# Altium project VM03_hv4.PrjPcb
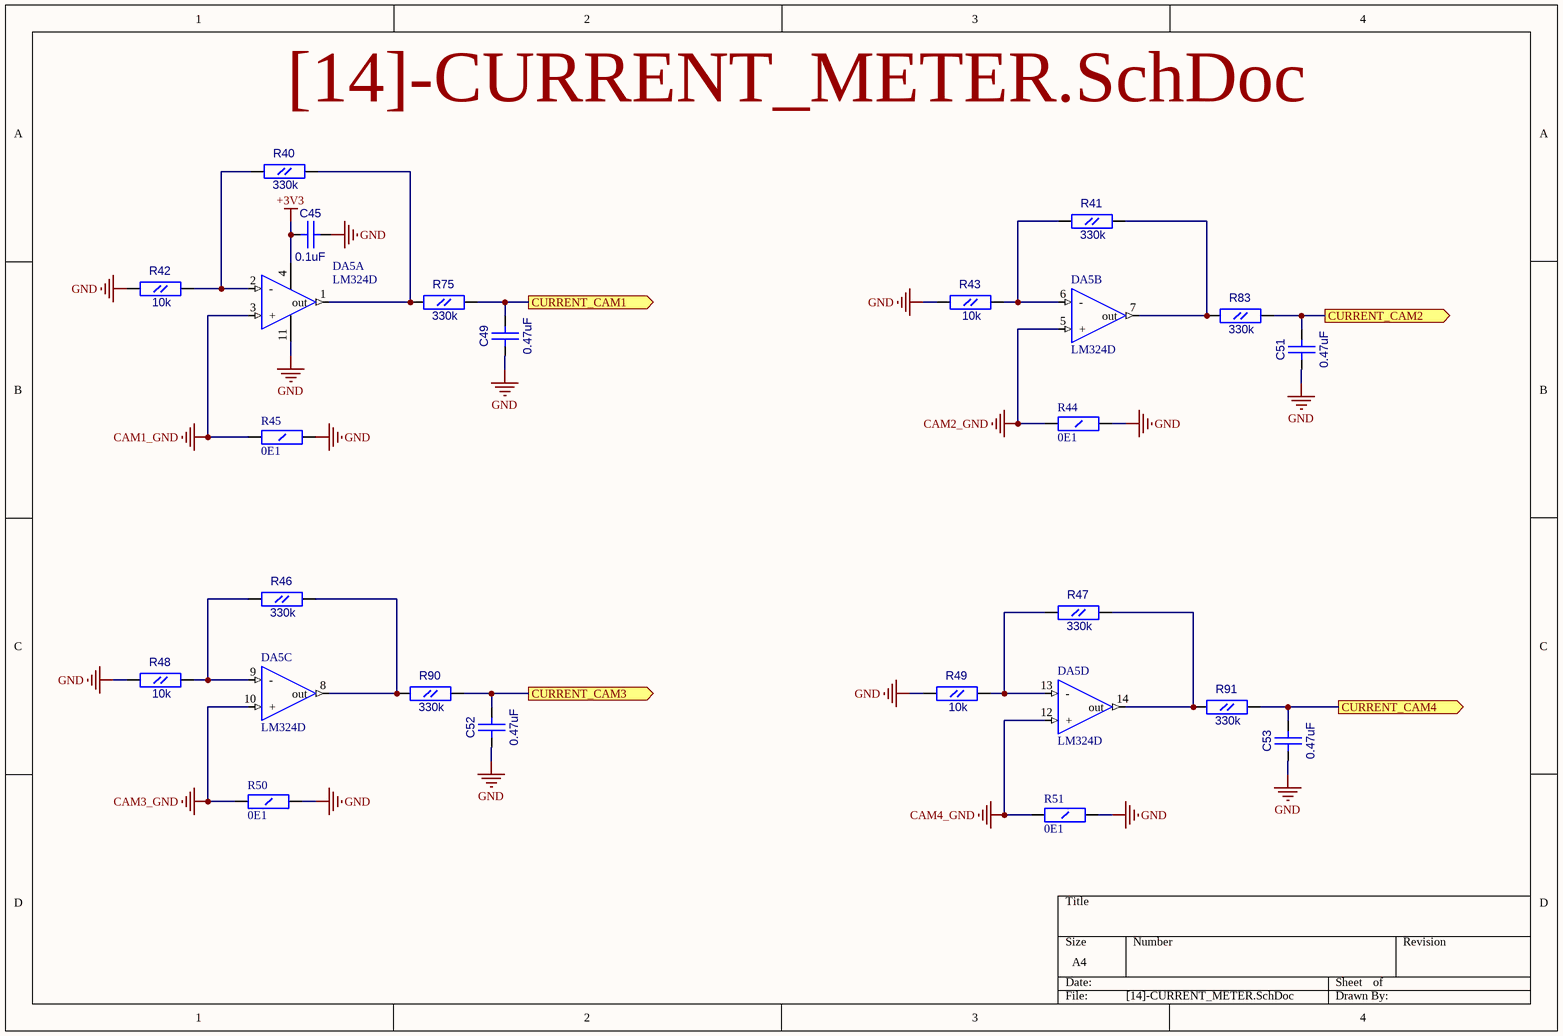
[diagram p0: [14]-CURRENT_METER.SchDoc]
3 sheets, 50 parts. Net scope: flat (ports and power ports of the same name join across sheets).
Board file: VM03_hv4.PcbDoc
Sheets:
  [14]-CURRENT_METER.SchDoc
  [17]-ETH_CONNECTOR.SchDoc
  [18]-WIFI_MODULE.SchDoc

## Sheet [14]-CURRENT_METER.SchDoc
size A4

### Parts
C45  0.1uF  [CC0603]
C49  0.47uF  [CC0603]
C51  0.47uF  [CC0603]
C52  0.47uF  [CC0603]
C53  0.47uF  [CC0603]
DA5  LM324D  [SO14]  (parts A,B,C,D of 4)
R40  330k  [RC0603]
R41  330k  [RC0603]
R42  10k  [RC0603]
R43  10k  [RC0603]
R44  0E1  [R2512]
R45  0E1  [R2512]
R46  330k  [RC0603]
R47  330k  [RC0603]
R48  10k  [RC0603]
R49  10k  [RC0603]
R50  0E1  [R2512]
R51  0E1  [R2512]
R75  330k  [RC0603]
R83  330k  [RC0603]
R90  330k  [RC0603]
R91  330k  [RC0603]

### Ports
CURRENT_CAM1 (out), CURRENT_CAM2 (out), CURRENT_CAM3 (out), CURRENT_CAM4 (out)

### Nets
+3V3: C45.1(A) DA5.4(V+)
CAM1_GND: DA5.3(+) R45.2(B)
CAM2_GND: DA5.5(+) R44.2(B)
CAM3_GND: DA5.10(+) R50.2(B)
CAM4_GND: DA5.12(+) R51.2(B)
GND: C45.2(B) C49.1(A) C51.1(A) C52.1(A) C53.1(A) DA5.11(V-) R42.1(A) R43.1(A) R44.1(A) R45.1(A) R48.1(A) R49.1(A) R50.1(A) R51.1(A)
NetC49_2: C49.2(B) R75.2(B) ; port CURRENT_CAM1
NetC51_2: C51.2(B) R83.2(B) ; port CURRENT_CAM2
NetC52_2: C52.2(B) R90.2(B) ; port CURRENT_CAM3
NetC53_2: C53.2(B) R91.2(B) ; port CURRENT_CAM4
NetDA5_1: DA5.1(out) R40.2(B) R75.1(A)
NetDA5_2: DA5.2(-) R40.1(A) R42.2(B)
NetDA5_6: DA5.6(-) R41.1(A) R43.2(B)
NetDA5_7: DA5.7(out) R41.2(B) R83.1(A)
NetDA5_8: DA5.8(out) R46.2(B) R90.1(A)
NetDA5_9: DA5.9(-) R46.1(A) R48.2(B)
NetDA5_13: DA5.13(-) R47.1(A) R49.2(B)
NetDA5_14: DA5.14(out) R47.2(B) R91.1(A)

### Library data of the parts
C45 C49 C51-C53 = CC0603
  C45: Value: 0.1uF
  C49 C51-C53: Value: 0.47uF
R40-R43 R46-R49 R75 R83 R90 R91 = RC0603
  R40 R41 R46 R47 R75 R83 R90 R91: Value: 330k
  R42 R43 R48 R49: Value: 10k
R44 R45 R50 R51 = RC2512: Resistor 2512 1W; Value: 0E1
DA5 = LM324D: Value: LM324D

## Sheet [17]-ETH_CONNECTOR.SchDoc
size A4
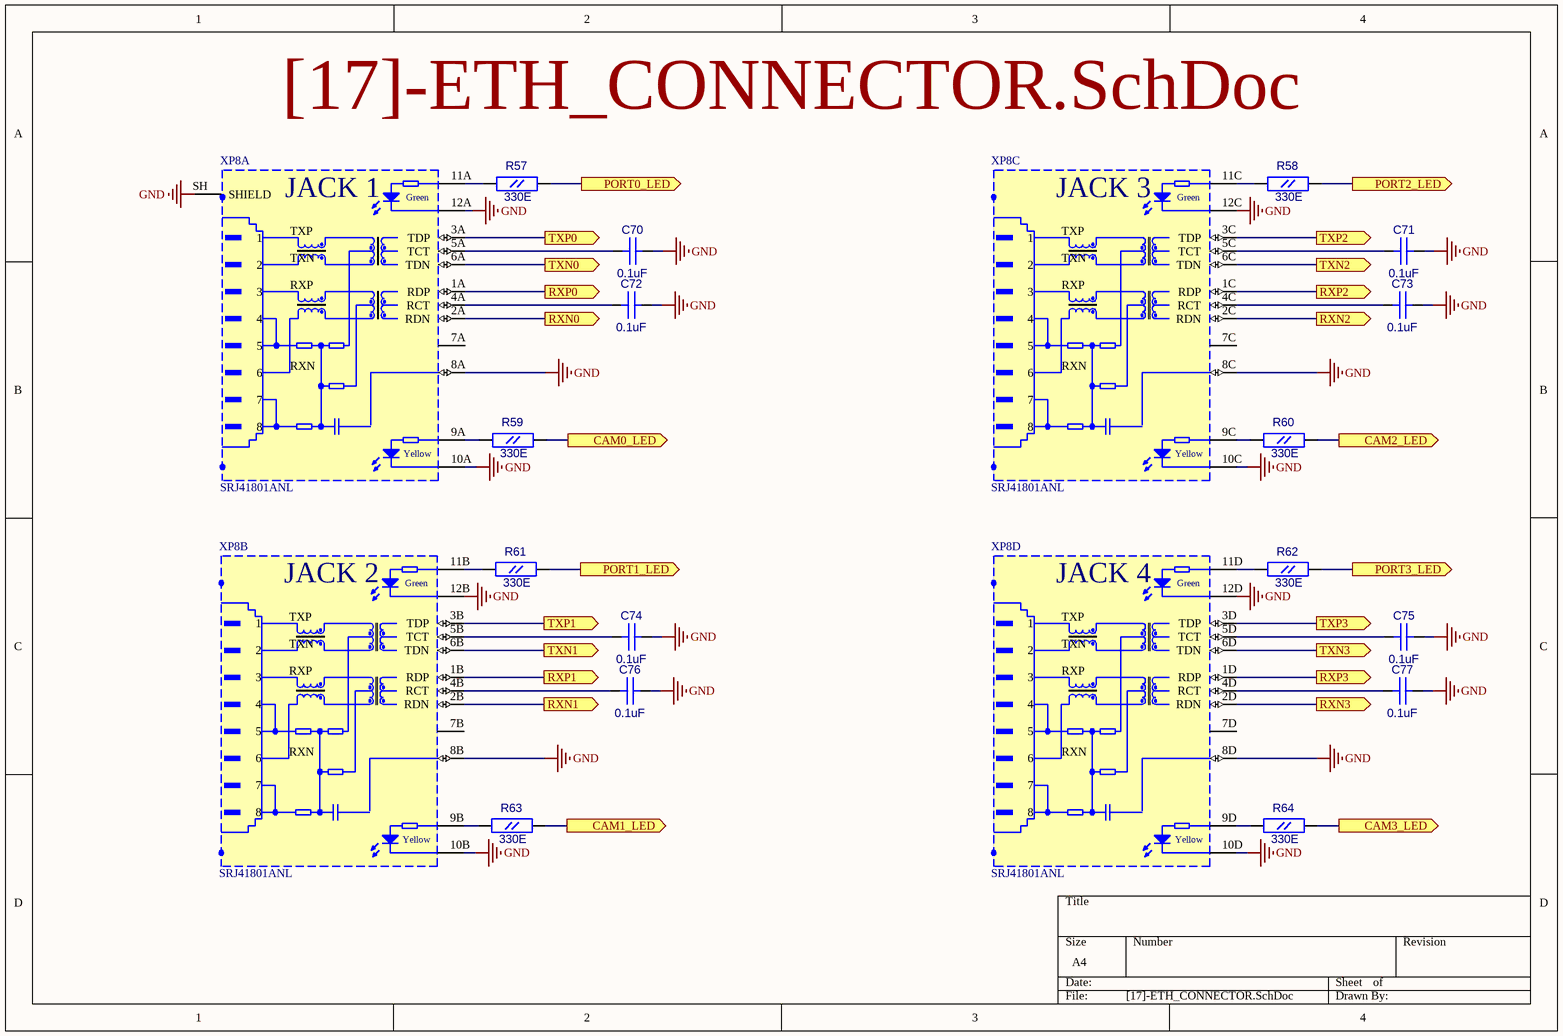
[diagram p1: [17]-ETH_CONNECTOR.SchDoc]

### Parts
C70  0.1uF  [CC0603]
C71  0.1uF  [CC0603]
C72  0.1uF  [CC0603]
C73  0.1uF  [CC0603]
C74  0.1uF  [CC0603]
C75  0.1uF  [CC0603]
C76  0.1uF  [CC0603]
C77  0.1uF  [CC0603]
R57  330E  [RC0603]
R58  330E  [RC0603]
R59  330E  [RC0603]
R60  330E  [RC0603]
R61  330E  [RC0603]
R62  330E  [RC0603]
R63  330E  [RC0603]
R64  330E  [RC0603]
XP8  SRJ41801ANL  [ETHERNET_RJ45_4PORTS]  (parts A,B,C,D of 4)

### Ports
CAM0_LED (out), CAM1_LED (out), CAM2_LED (out), CAM3_LED (out), PORT0_LED (out), PORT1_LED (out), PORT2_LED (out), PORT3_LED (out), RXN0 (out), RXN1 (out), RXN2 (out), RXN3 (out), RXP0 (out), RXP1 (out), RXP2 (out), RXP3 (out), TXN0 (out), TXN1 (out), TXN2 (out), TXN3 (out), TXP0 (out), TXP1 (out), TXP2 (out), TXP3 (out)

### Nets
GND: C70.2(B) C71.2(B) C72.2(B) C73.2(B) C74.2(B) C75.2(B) C76.2(B) C77.2(B) XP8.8A XP8.8B XP8.8C XP8.8D XP8.10A(D4) XP8.10B(D4) XP8.10C(D4) XP8.10D(D4) XP8.12A(D2) XP8.12B(D2) XP8.12C(D2) XP8.12D(D2) XP8.SH(SHIELD)
NetC70_1: C70.1(A) XP8.5A(TCT)
NetC71_1: C71.1(A) XP8.5C(TCT)
NetC72_1: C72.1(A) XP8.4A(RCT)
NetC73_1: C73.1(A) XP8.4C(RCT)
NetC74_1: C74.1(A) XP8.5B(TCT)
NetC75_1: C75.1(A) XP8.5D(TCT)
NetC76_1: C76.1(A) XP8.4B(RCT)
NetC77_1: C77.1(A) XP8.4D(RCT)
NetR57_1: R57.1(A) XP8.11A(D1)
NetR57_2: R57.2(B) ; port PORT0_LED
NetR58_1: R58.1(A) XP8.11C(D1)
NetR58_2: R58.2(B) ; port PORT2_LED
NetR59_1: R59.1(A) XP8.9A(D3)
NetR59_2: R59.2(B) ; port CAM0_LED
NetR60_1: R60.1(A) XP8.9C(D3)
NetR60_2: R60.2(B) ; port CAM2_LED
NetR61_1: R61.1(A) XP8.11B(D1)
NetR61_2: R61.2(B) ; port PORT1_LED
NetR62_1: R62.1(A) XP8.11D(D1)
NetR62_2: R62.2(B) ; port PORT3_LED
NetR63_1: R63.1(A) XP8.9B(D3)
NetR63_2: R63.2(B) ; port CAM1_LED
NetR64_1: R64.1(A) XP8.9D(D3)
NetR64_2: R64.2(B) ; port CAM3_LED
NetXP8_1A: XP8.1A(RDP) ; port RXP0
NetXP8_1B: XP8.1B(RDP) ; port RXP1
NetXP8_1C: XP8.1C(RDP) ; port RXP2
NetXP8_1D: XP8.1D(RDP) ; port RXP3
NetXP8_2A: XP8.2A(RDN) ; port RXN0
NetXP8_2B: XP8.2B(RDN) ; port RXN1
NetXP8_2C: XP8.2C(RDN) ; port RXN2
NetXP8_2D: XP8.2D(RDN) ; port RXN3
NetXP8_3A: XP8.3A(TDP) ; port TXP0
NetXP8_3B: XP8.3B(TDP) ; port TXP1
NetXP8_3C: XP8.3C(TDP) ; port TXP2
NetXP8_3D: XP8.3D(TDP) ; port TXP3
NetXP8_6A: XP8.6A(TDN) ; port TXN0
NetXP8_6B: XP8.6B(TDN) ; port TXN1
NetXP8_6C: XP8.6C(TDN) ; port TXN2
NetXP8_6D: XP8.6D(TDN) ; port TXN3

Not connected (* = marked no-connect by the designer): XP8 7A(7) 7B(7) 7C(7) 7D(7)

### Notes on the sheet
- (in symbol SRJ41801ANL, part A) Green; JACK 1; TXP; 1; TXN; 2; RXP; 3; 4; 5; RXN; 6; Yellow
- (in symbol SRJ41801ANL, part B) Green; JACK 2; TXP; 1; TXN; 2; RXP; 3; 4; 5; RXN; 6; Yellow
- (in symbol SRJ41801ANL, part C) Green; JACK 3; TXP; 1; TXN; 2; RXP; 3; 4; 5; RXN; 6; Yellow
- (in symbol SRJ41801ANL, part D) Green; JACK 4; TXP; 1; TXN; 2; RXP; 3; 4; 5; RXN; 6; Yellow

### Library data of the parts
C70-C77 = CC0603: Value: 0.1uF
R57-R64 = RC0603: Value: 330E
XP8 = SRJ41801ANL: 4 Ports RJ45 Ethernet connector; Value: SRJ41801ANL

## Sheet [18]-WIFI_MODULE.SchDoc
size A4
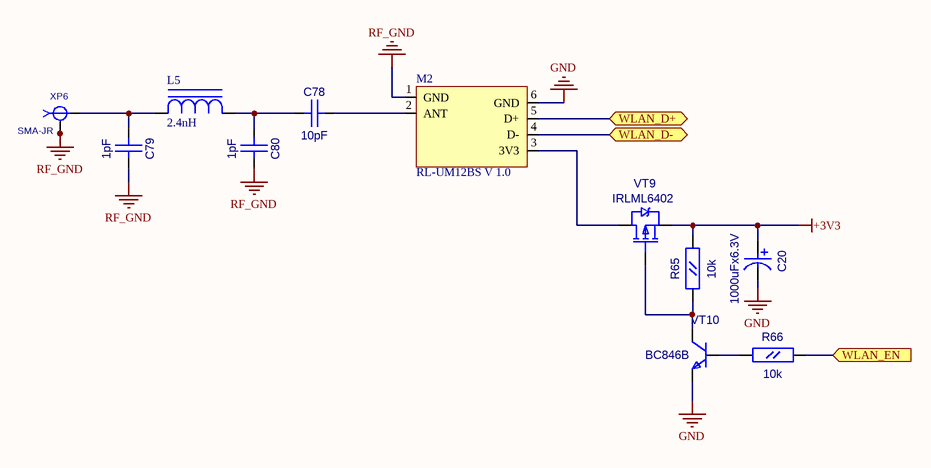
[diagram p2: [18]-WIFI_MODULE.SchDoc]

### Parts
C20  1000uFx6.3V  [CC8X3.5]
C78  10pF  [CC0603]
C79  1pF  [CC0603]
C80  1pF  [CC0603]
L5  2.4nH  [L0402]
M2  RL-UM12BS V 1.0  [RTL8188_MODULE]
R65  10k  [RC0603]
R66  10k  [RC0603]
VT9  IRLML6402  [SOT-23(123)]
VT10  BC846B  [SOT-23(123)]
XP6  SMA-JR  [SMA-JR]

### Ports
WLAN_D+ (bidir), WLAN_D- (bidir), WLAN_EN (in)

### Nets
+3V3: C20.1 R65.2(B) VT9.2(S)
GND: C20.2 M2.6(GND) VT10.2(E)
RF_GND: C79.2(B) C80.2(B) M2.1(GND) XP6.2 XP6.3 XP6.4 XP6.5
NetC78_1: C78.1(A) C80.1(A) L5.2(C)
NetC78_2: C78.2(B) M2.2(ANT)
NetC79_1: C79.1(A) L5.1(A) XP6.1
NetM2_3: M2.3(3V3) VT9.3(D)
NetM2_4: M2.4(D-) ; port WLAN_D-
NetM2_5: M2.5(D+) ; port WLAN_D+
NetR65_1: R65.1(A) VT9.1(G) VT10.3(C)
NetR66_1: R66.1(A) VT10.1(B)
NetR66_2: R66.2(B) ; port WLAN_EN

### Library data of the parts
C20 = CAP_8mm: Radial capacitor; Value: 1000uFx6.3V
C78-C80 = CC0603
  C78: Value: 10pF
  C79 C80: Value: 1pF
L5 = L0402: Value: 2.4nH
M2 = RTL8188_MODULE: Value: RL-UM12BS V 1.0
R65 R66 = RC0603: Value: 10k
VT9 = IRLML6402: HEXFET Power MOSFET; OriginalName: IRLML5103; ComponentField7: Published 8-Jun-2000; Value: IRLML6402
VT10 = BC846BLT1: ComponentField7: Published 29-Sep-2000; OriginalName: BC846BLT1; Value: BC846B
XP6 = SMA-JR: Value: SMA-JR

## Nets that join several sheets
+3V3: [14]-CURRENT_METER (C45.1 DA5.4), [18]-WIFI_MODULE (C20.1 R65.2 VT9.2)
GND: [14]-CURRENT_METER (14 pins), [17]-ETH_CONNECTOR (21 pins), [18]-WIFI_MODULE (C20.2 M2.6 VT10.2)